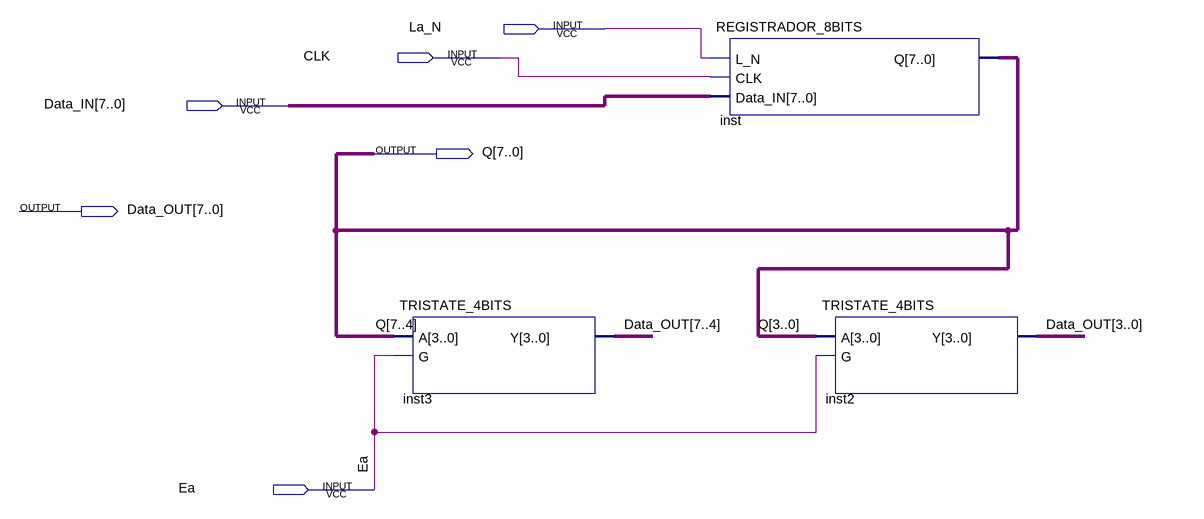
[diagram p0: schematic sheet]
// Quartus schematic Acumulador_A.bdf as structural Verilog: 3 symbols, 6 pins
module Acumulador_A (
  input  La_N,
  input  CLK,
  input  [7:0] Data_IN,
  input  Ea,
  output [7:0] Q,
  output [7:0] Data_OUT
);

  TRISTATE_4BITS inst3 (.A(Q[7:4]), .G(Ea), .Y(Data_OUT[7:4]));
  REGISTRADOR_8BITS inst (.L_N(La_N), .CLK(CLK), .Data_IN(Data_IN), .Q(Q));
  TRISTATE_4BITS inst2 (.A(Q[3:0]), .G(Ea), .Y(Data_OUT[3:0]));
endmodule
